# Altium schematic sheet 01_CPU.SchDoc: Sheet Description
size A3; Organization: Organization; Address1: Address1; Address2: Address2; Address3: Address3; Address4: Address4; DocumentNumber: 1; Revision: 0; SheetNumber: 1; SheetTotal: 2; PageSetup: Record=PageOptions|CenterHorizontal=True|CenterVertical=True|PrintScale=1.00|XCorrection=1.00|YCorrection=1.00|PrintKind=1|BorderSize=5000000|LeftOffset=0|BottomOffset=0|Orientation=2|PaperLength=1000|PaperWidth=1000|Scale=100|PaperSource=7|PrintQuality=-4|MediaType=1|DitherType=10|PaperKind=A3|PrintScaleMode=0
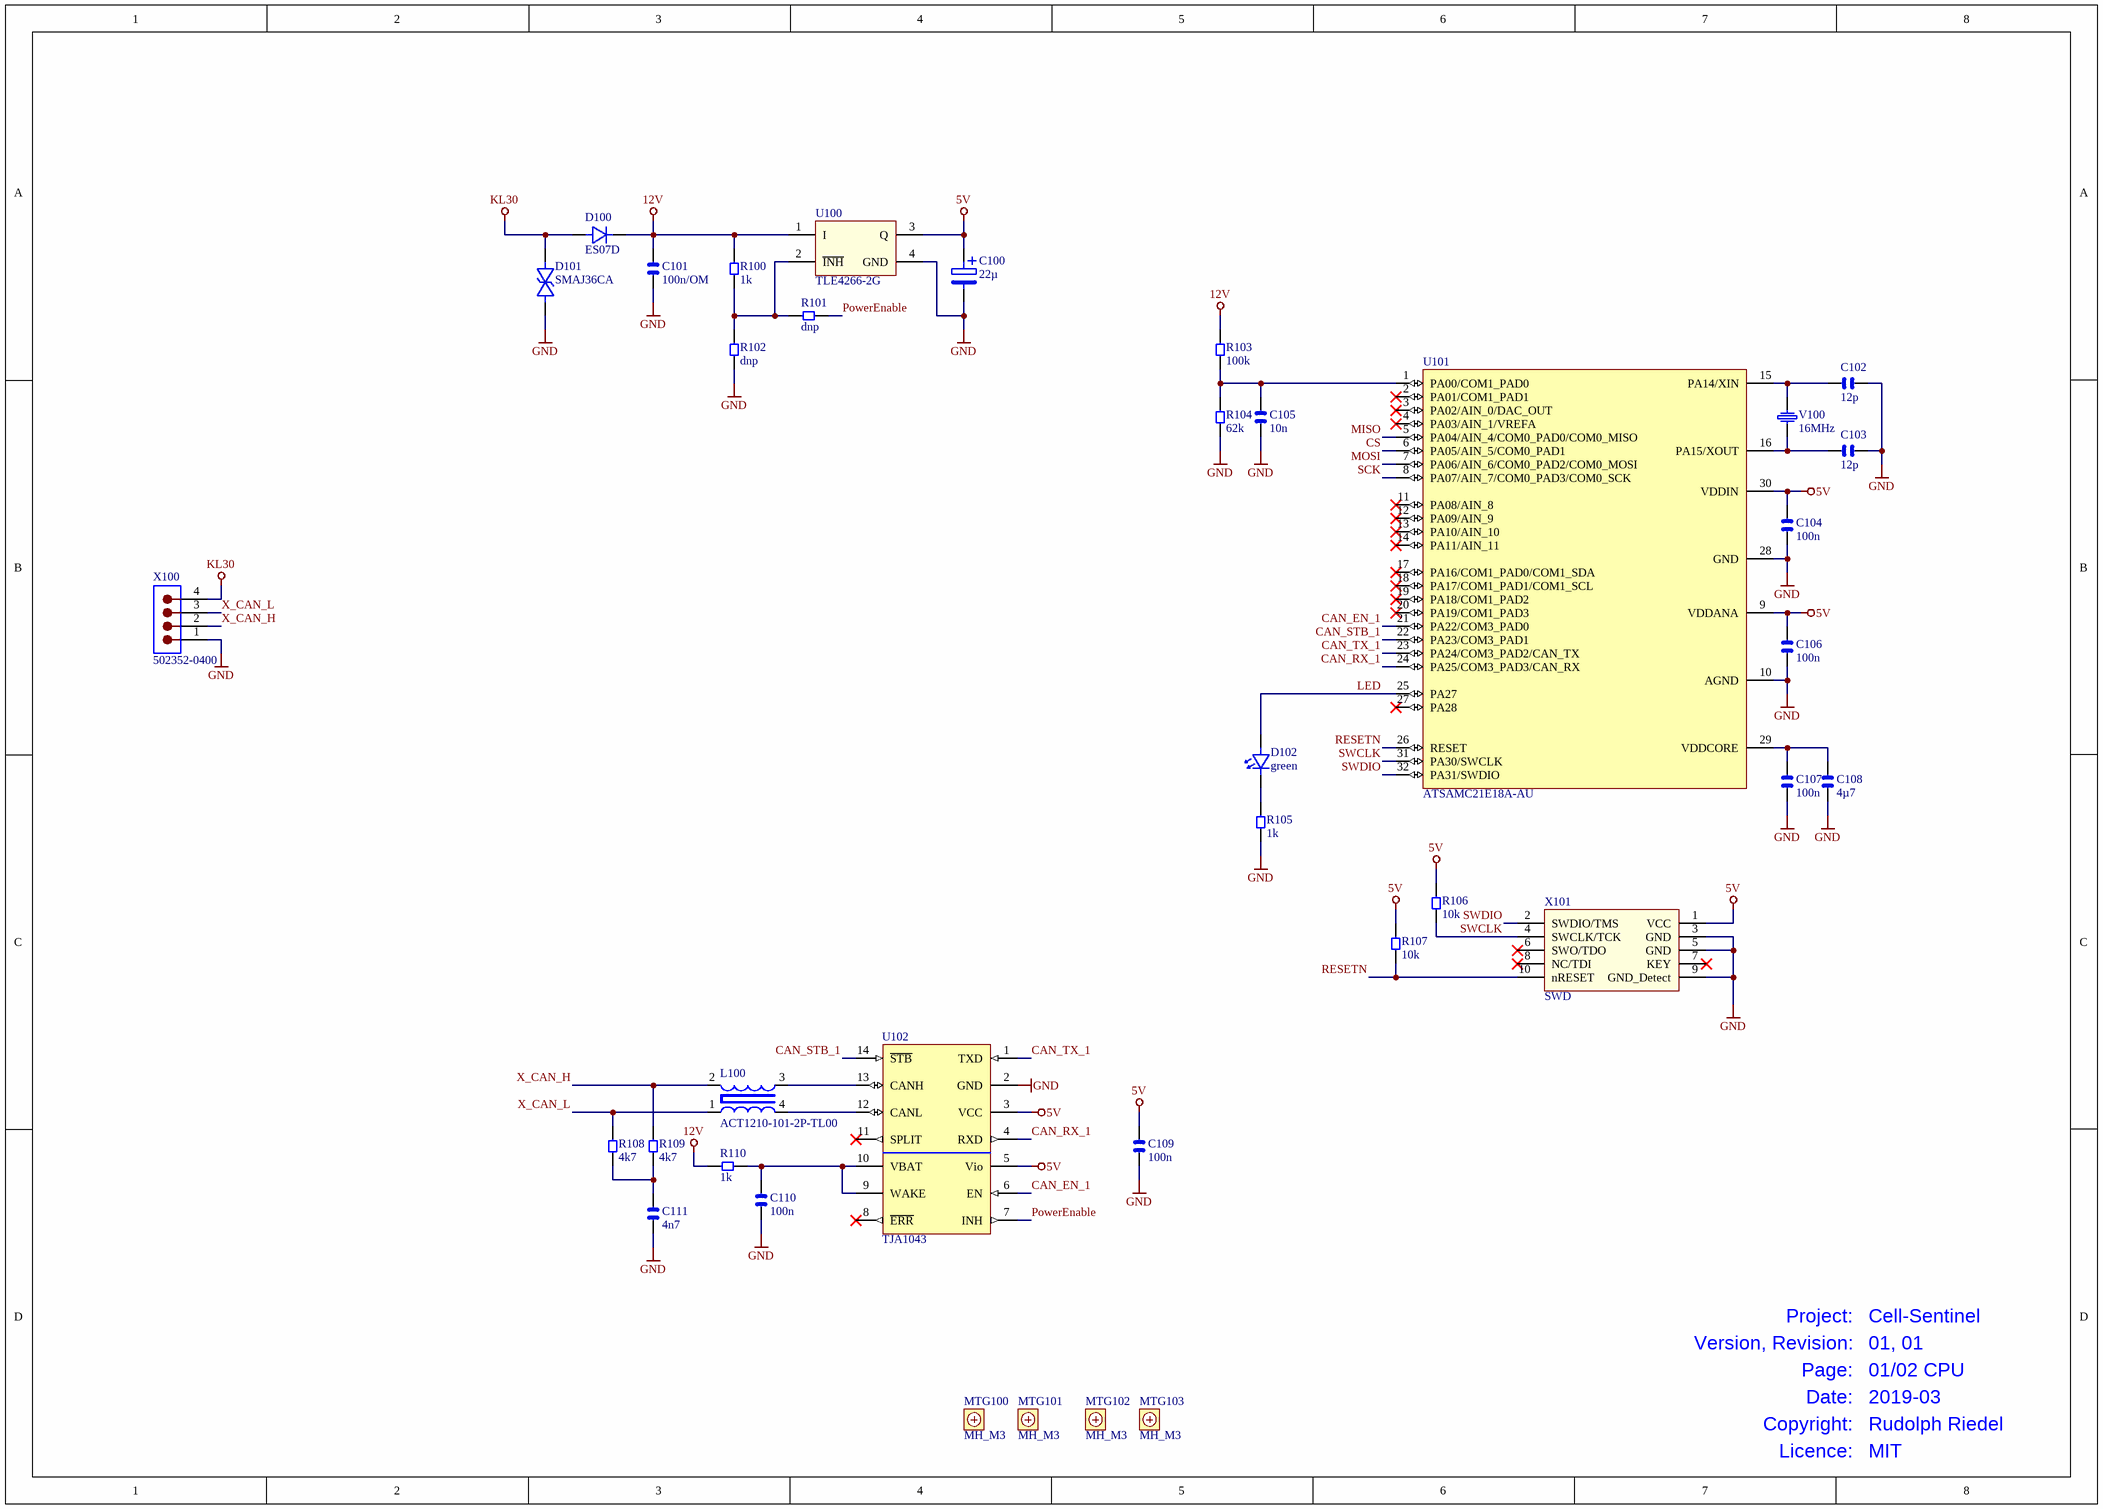
[diagram p0: 01_CPU.SchDoc]

## Parts
C100  22µ  [CAPMP3528X21N]
C101  100n/OM  [CAPC2012X14L]
C102  12p  [CAPC2012X14L]
C103  12p  [CAPC2012X14L]
C104  100n  [CAPC1608X09L]
C105  10n  [CAPC2012X14L]
C106  100n  [CAPC1608X09L]
C107  100n  [CAPC1608X09L]
C108  4µ7  [CAPC2012X14L]
C109  100n  [CAPC2012X14L]
C110  100n  [CAPC2012X14L]
C111  4n7  [CAPC2012X14L]
D100  ES07D  [DIOM2818X11N]
D101  SMAJ36CA  [DIOM5226X23N]
D102  green  [DIOC2012X10N]
L100  ACT1210-101-2P-TL00  [ACT1210]
MTG100  MH_M3  [HOLE_3_2MM]  (no BOM)
MTG101  MH_M3  [HOLE_3_2MM]  (no BOM)
MTG102  MH_M3  [HOLE_3_2MM]  (no BOM)
MTG103  MH_M3  [HOLE_3_2MM]  (no BOM)
R100  1k  [RESC2012X06L]
R101  dnp  [RESC2012X06L]
R102  dnp  [RESC2012X06L]
R103  100k  [RESC2012X06L]
R104  62k  [RESC2012X06L]
R105  1k  [RESC2012X06L]
R106  10k  [RESC2012X06L]
R107  10k  [RESC2012X06L]
R108  4k7  [RESC3216X07N]
R109  4k7  [RESC3216X07N]
R110  1k  [RESC2012X06L]
U100  TLE4266-2G  [SOT230P700X180-4N]
U101  ATSAMC21E18A-AU  [TQFP80P900X900X120-32N]
U102  TJA1043  [SOIC127P600X175-14N]
V100  16MHz  [NX3225Gx]
X100  502352-0400  [502352-0400]
X101  SWD  [FTSH-105-01-L-DV-K]

## Nets
5V: C100.1 C104.2 C106.2 C109.2 R106.2 R107.2 U100.3(Q) U101.9(VDDANA) U101.30(VDDIN) U102.3(VCC) U102.5(Vio) X101.1(VCC)
12V: C101.2 D100.1 R100.2 R103.2 R110.1 U100.1(I)
GND: C100.2 C101.1 C102.2 C103.2 C104.1 C105.1 C106.1 C107.1 C108.1 C109.1 C110.1 C111.1 D101.1 R102.1 R104.1 R105.1 U100.4(GND) U101.10(AGND) U101.28(GND) U102.2(GND) X100.1 X101.3(GND) X101.5(GND) X101.9(GND_Detect)
KL30: D100.2 D101.2 X100.4
CAN_EN_1: U101.21(PA22/COM3_PAD0) U102.6(EN)
CAN_RX_1: U101.24(PA25/COM3_PAD3/CAN_RX) U102.4(RXD)
CAN_STB_1: U101.22(PA23/COM3_PAD1) U102.14(~{STB})
CAN_TX_1: U101.23(PA24/COM3_PAD2/CAN_TX) U102.1(TXD)
CS: U101.6(PA05/AIN_5/COM0_PAD1)
LED: D102.2 U101.25(PA27)
MISO: U101.5(PA04/AIN_4/COM0_PAD0/COM0_MISO)
MOSI: U101.7(PA06/AIN_6/COM0_PAD2/COM0_MOSI)
PowerEnable: R101.1 U102.7(INH)
RESETN: R107.1 U101.26(RESET) X101.10(nRESET)
SCK: U101.8(PA07/AIN_7/COM0_PAD3/COM0_SCK)
SWCLK: R106.1 U101.31(PA30/SWCLK) X101.4(SWCLK/TCK)
SWDIO: U101.32(PA31/SWDIO) X101.2(SWDIO/TMS)
X_CAN_H: L100.2 R109.2 X100.2
X_CAN_L: L100.1 R108.2 X100.3
NetC102_1: C102.1 U101.15(PA14/XIN) V100.2
NetC103_1: C103.1 U101.16(PA15/XOUT) V100.1
NetC105_2: C105.2 R103.1 R104.2 U101.1(PA00/COM1_PAD0)
NetC107_2: C107.2 C108.2 U101.29(VDDCORE)
NetC110_2: C110.2 R110.2 U102.9(WAKE) U102.10(VBAT)
NetC111_2: C111.2 R108.1 R109.1
NetD102_1: D102.1 R105.2
NetL100_3: L100.3 U102.13(CANH)
NetL100_4: L100.4 U102.12(CANL)
NetR100_1: R100.1 R101.2 R102.2 U100.2(~{INH})

Not connected (* = marked no-connect by the designer): U101 2(PA01/COM1_PAD1)* 3(PA02/AIN_0/DAC_OUT)* 4(PA03/AIN_1/VREFA)* 11(PA08/AIN_8)* 12(PA09/AIN_9)* 13(PA10/AIN_10)* 14(PA11/AIN_11)* 17(PA16/COM1_PAD0/COM1_SDA)* 18(PA17/COM1_PAD1/COM1_SCL)* 19(PA18/COM1_PAD2)* 20(PA19/COM1_PAD3)* 27(PA28)*; U102 8(~{ERR})* 11(SPLIT)*; X101 6(SWO/TDO)* 7(KEY)* 8(NC/TDI)*

## Notes on the sheet
- Project:
- Cell-Sentinel
- Version, Revision:
- Page:
- 01, 01
- 01/02 CPU
- Date:
- Copyright:
- Licence:
- 2019-03
- Rudolph Riedel
- MIT

## Library data of the parts
C100 = CAPMP_B: Tantalkondensator SMD Bauform B; Ersteller: rriedel; Freigabe: tested; Kategorie: generisch; Unterart: gepolt; Part Number: CAPMP_B; Value: 22µ; Bauteilart: Kondensator; PackageDescription: Tantal B
C101-C103 C105 C108-C111 = CAPC_0805: 0805 Chip Capacitor; Ersteller: rriedel; Freigabe: tested; Bauteilart: Kondensator; Kategorie: generisch; Unterart: ungepolt; Part Number: CAPC_0805; PackageDescription: 0805
  C101: Value: 100n/OM
  C102 C103: Value: 12p
  C105: Value: 10n
  C108: Value: 4µ7
  C109 C110: Value: 100n
  C111: Value: 4n7
C104 C106 C107 = CAPC_0603: 0603 Chip Capacitor; Ersteller: rriedel; Freigabe: tested; Bauteilart: Kondensator; Kategorie: generisch; Unterart: ungepolt; Part Number: CAPC_0603; Value: 100n; PackageDescription: 0603
D100 = ES07D: Ultrafast Rectifier Surface Mount,  IF 0.5A, VR 100V, DO-219AB, AEC-Q101; Ersteller: rriedel; Freigabe: tested; Bauteilart: Diode; Kategorie: Bauteil; Hersteller: Vishay; Part Number: ES07D; Value: ES07D; Erstelldatum: 09.10.2013; Unterart: Rectifier; PackageDescription: DO-219AB; Hersteller_Code_1: ES07D
D101 = SMAJ36CA: Transildiode Bidirectional 400W 36V; Ersteller: rriedel; Freigabe: tested; Bauteilart: Diode; Kategorie: Bauteil; Hersteller: DIODES; Hersteller_Code_1: SMAJ36CA-13-F; Part Number: SMAJ36CA; Value: SMAJ36CA; Erstelldatum: 15.09.2016; Unterart: Transil; PackageDescription: SMA
D102 = LED_0805: LED, 0805; Ersteller: rriedel; Freigabe: tested; Bauteilart: Diode; Kategorie: generisch; Part Number: LED_0805; Value: green; Erstelldatum: 25.07.2017; PackageDescription: 0805
L100 = ACT1210-101-2P-TL00: Common Mode Filter,  -50°C ... +150°C, AEC-Q200; Ersteller: rriedel; Freigabe: tested; Bauteilart: Spule; Kategorie: Bauteil; Hersteller: TDK; Part Number: ACT1210-101-2P-TL00; Value: ACT1210-101-2P-TL00; Erstelldatum: 17.10.2017; Unterart: Filter; PackageDescription: 3225; Hersteller_Code_1: ACT1210-101-2P-TL00; Distributor_1: Farnell; Distributor_1_Part_Number: 2442838; Distributor_2: Digi-Key; Distributor_2_Part_Number: 445-172386-1-ND
MTG100-MTG103 = MH_M3: Mounting-Hole for M3 screws; Ersteller: rriedel; Freigabe: tested; Bauteilart: Mechanic; Kategorie: No_Bom; Unterart: Holes; Part Number: MH_M3; Value: MH_M3; Erstelldatum: 13.05.2018
R100-R107 R110 = RESC_0805: 0805 Chip Resistor; Ersteller: rriedel; Freigabe: tested; Bauteilart: Widerstand; Kategorie: generisch; Unterart: Standard; Part Number: RESC_0805; PackageDescription: 0805
  R100 R105 R110: Value: 1k
  R101 R102: Value: dnp
  R103: Value: 100k
  R104: Value: 62k
  R106 R107: Value: 10k
R108 R109 = RESC_1206: 1206 Chip Resistor; Ersteller: rriedel; Freigabe: tested; Bauteilart: Widerstand; Kategorie: generisch; Unterart: Standard; Part Number: RESC_1206; Value: 4k7; PackageDescription: 1206
U100 = TLE4266-2G: 150 mA LDO, Vout = 5,0V, 2%, Enable; Ersteller: rriedel; Freigabe: tested; Bauteilart: IC; Kategorie: Bauteil; Unterart: Linear-Regulators; Hersteller: Infineon; Part Number: TLE4266-2G; Value: TLE4266-2G; Erstelldatum: 31.03.2019; PackageDescription: SOT223; Hersteller_Code_1: TLE4266-2G; Distributor_1: Digi-Key; Distributor_2: Farnell
U101 = ATSAMC21E18A-AU: 32-bit Microcontroller, 48MHz Cortex M0, 256k FLASH,  1x CAN-FD, -40…85°C; Ersteller: rriedel; Freigabe: tested; Bauteilart: MikroController; Kategorie: Bauteil; Unterart: 32bit Microchip; Hersteller: Microchip; Part Number: ATSAMC21E18A-AU; Value: ATSAMC21E18A-AU; Erstelldatum: 11.08.2018; PackageDescription: TQFP32; Hersteller_Code_1: ATSAMC21E18A-AU
U102 = TJA1043T: HS Can Transceiver with wake-up Tvj= -40 to 150 °C; Ersteller: rriedel; Freigabe: tested; Bauteilart: IC; Kategorie: Bauteil; Unterart: Interface; Hersteller: NXP; Part Number: TJA1043T; Value: TJA1043; Erstelldatum: 10.10.2012; PackageDescription: SO14; Hersteller_Code_1: TJA1043T
V100 = NX3225GB-16.000000MHZ: 16.000MHz Crystal SMD, 3.2x2.5mm, 8pF, 50ppm,  -40..+150°C; Ersteller: rriedel; Freigabe: tested; Bauteilart: Quarz; Kategorie: Bauteil; Unterart: NX3225GB automotive; Hersteller: NDK; Hersteller_Code_1: NX3225GB-16M-STD-CRA-2; Part Number: NX3225GB-16.000000MHZ; Value: 16MHz; Erstelldatum: 22.10.2015; PackageDescription: NX3225Gx 3,2mm x 2,5mm; Distributor_1: Digi-Key; Distributor_1_Part_Number: 644-1233-1-ND; Distributor_2: Frischer
X100 = Molex-502352-0400: Molex PCB Header DuraClik 4pins, SMD, -40°C to +105°C; Ersteller: rriedel; Freigabe: tested; Bauteilart: Steckverbinder; Kategorie: Bauteil; Unterart: Molex DuraClik; Part Number: Molex-502352-0400; Value: 502352-0400; Erstelldatum: 23.11.2017; PackageDescription: DuraClik-4; Hersteller: Molex; Hersteller_Code_1: 502352-0400; Distributor_1: Farnell; Distributor_1_Part_Number: 2067041
X101 = SWD: ARM Debug-Header 2x5 1,27 mm; Ersteller: rriedel; Freigabe: tested; Bauteilart: Steckverbinder; Kategorie: Bauteil; Unterart: Debug; Part Number: SWD; Value: SWD; Erstelldatum: 12.08.2018; PackageDescription: 2x5 1,27mm